# EAGLE design Mono_i2c_v2+TEMP (EAGLE 7.3.0)
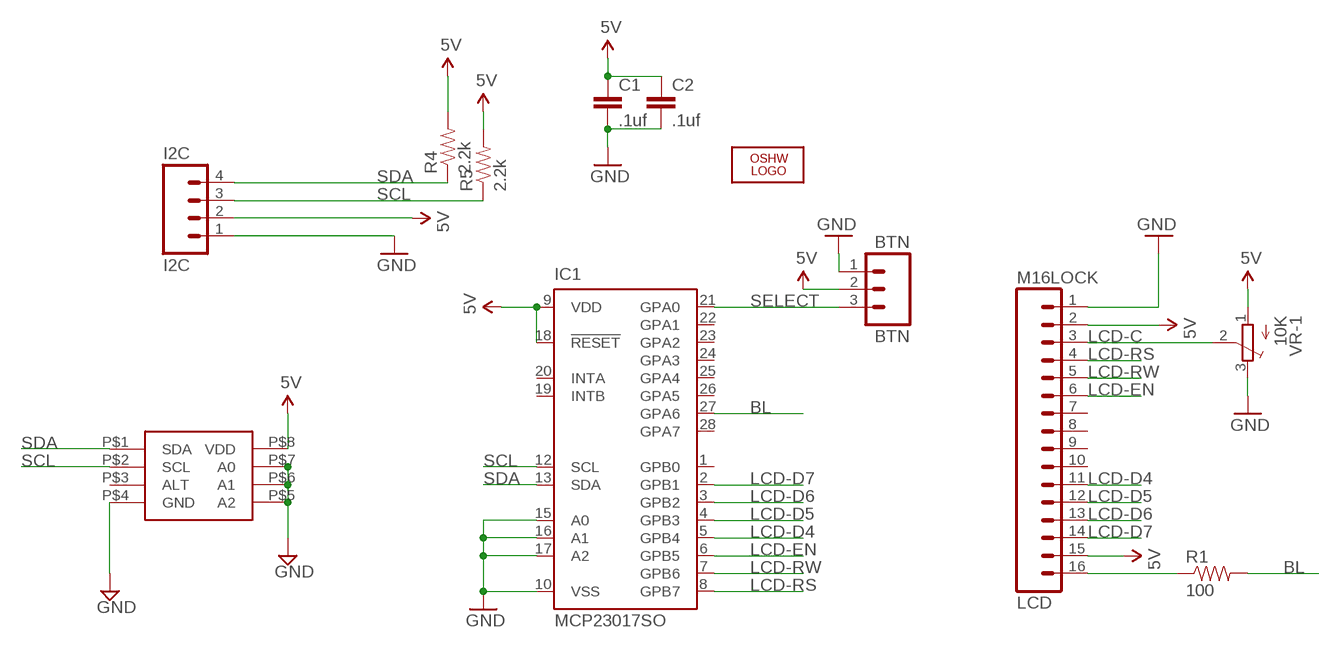
[diagram p0: schematic, sheet 1]

## Parts
BTN  BTN  M03LOCK  [1X03_LOCK]
C1  .1uf  CAP0805  [0805]
C2  .1uf  CAP0805  [0805]
I2C  I2C  M04LOCK  [1X04_LOCK]
IC1  MCP23017SO  [SO28W]
IC2  MCP9808  [MSOP8]
LCD  M16LOCK  [1X16_LOCK]
LOGO2  OSHW_LOGO_10MILX0350-NT  [OSHW_10X350_NOTEXT]
R1  100  RESISTOR0805-RES  [0805]
R4  2.2k  RESISTOR0805-RES  [0805]
R5  2.2k  RESISTOR0805-RES  [0805]
VR-1  10K  TRIMPOTTC33X  [TC33X]

## Nets
5V: BTN.2 C1.1 C2.1 I2C.2 IC1.9(VDD) IC1.18(!RESET) IC2.P$8(VDD) LCD.2 LCD.15 R4.2 R5.2 VR-1.1(A)
BL: IC1.27(GPA6) R1.2
GND: BTN.1 C1.2 C2.2 I2C.1 IC1.10(VSS) IC1.15(A0) IC1.16(A1) IC1.17(A2) IC2.P$4(GND) IC2.P$5(A2) IC2.P$6(A1) IC2.P$7(A0) LCD.1 VR-1.3(E)
LCD-C: LCD.3 VR-1.2(S)
LCD-D4: IC1.5(GPB4) LCD.11
LCD-D5: IC1.4(GPB3) LCD.12
LCD-D6: IC1.3(GPB2) LCD.13
LCD-D7: IC1.2(GPB1) LCD.14
LCD-EN: IC1.6(GPB5) LCD.6
LCD-RS: IC1.8(GPB7) LCD.4
LCD-RW: IC1.7(GPB6) LCD.5
N$4: LCD.16 R1.1
SCL: I2C.3 IC1.12(SCL) IC2.P$2(SCL) R5.1
SDA: I2C.4 IC1.13(SDA) IC2.P$1(SDA) R4.1
SELECT: BTN.3 IC1.21(GPA0)
Unconnected: IC1.1(GPB0) IC1.19(INTB) IC1.20(INTA) IC1.22(GPA1) IC1.23(GPA2) IC1.24(GPA3) IC1.25(GPA4) IC1.26(GPA5) IC1.28(GPA7) IC2.P$3(ALT) LCD.7 LCD.8 LCD.9 LCD.10

## Library data of the parts
BTN = SparkFun:M03: Header 3 Standard 3-pin 0.1" header. Use with straight break away headers (SKU : PRT-00116), right angle break away headers (PRT-00553), swiss pins (PRT-00743), machine pins (PRT-00117), and female headers (PRT-00115). Molex polarized connector foot print use with SKU : PRT-08232 with associated crimp pins and housings.
C1 C2 = SparkFun:CAP: Capacitor Standard 0603 ceramic capacitor, and 0.1" leaded capacitor.
I2C = SparkFun:M04: Header 4 Standard 4-pin 0.1" header. Use with straight break away headers (SKU : PRT-00116), right angle break away headers (PRT-00553), swiss pins (PRT-00743), machine pins (PRT-00117), and female headers (PRT-00115). Molex polarized connector foot print use with SKU : PRT-08231 with associated crimp pins and housings. 1MM SMD Version SKU: PRT-10208
IC1 = adafruit:MCP23017: http://ww1.microchip.com/downloads/en/DeviceDoc/21952a.pdf Source: http://ww1.microchip.com/downloads/en/DeviceDoc/21952a.pdf
IC2 = OpenEVSE:MCP9808
LCD = SparkFun:M16
LOGO2 = ohw-logo:OSHW_LOGO_10MIL
R1 R4 R5 = SparkFun:RESISTOR: Resistor Basic schematic elements and footprints for 0603, 1206, and PTH resistors.
VR-1 = adafruit:TRIMPOT: SMT trimmer potentiometer part number TC33X http://www.ladyada.net/library/eagle

## Board
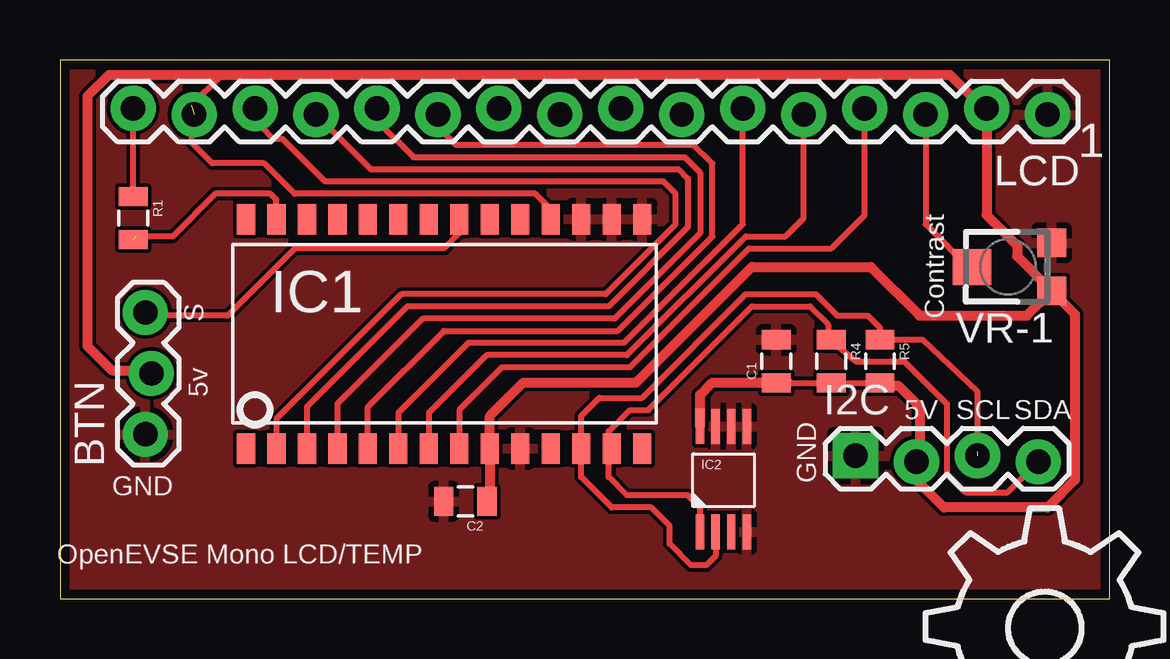
[diagram p1: board, top side]
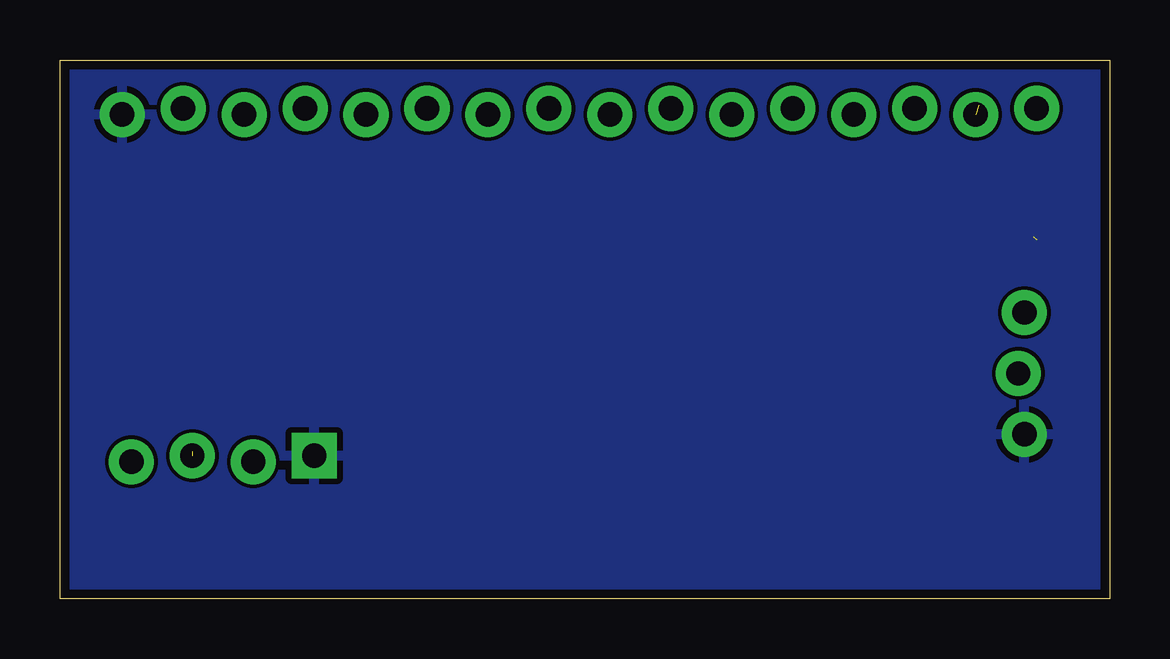
[diagram p2: board, bottom side, seen from below]

Size 43.74 x 22.47 mm. Coordinates in mm from the lower left corner, seen from the top.
Outline: 0,0 43.74,0 43.74,22.47 0,22.47 0,0
Copper layers (1*16): Top 0.0356mm / dielectric 1.5011mm / Bottom 0.0356mm
Design rules "default": minimum track width 6mil, minimum drill 13mil, track to track 6mil, track to pad 6mil, pad to pad 6mil, via to via 6mil, smd to smd 6mil, copper to edge 15mil, drill to drill 6mil, minimum pad ring 7mil, minimum via ring 7mil, stop-mask expansion 4mil, vias tented up to drill 0mil, thermal gap 10mil

### Footprints (pad centres in the part's own frame; a part is rotated, then mirrored left to right if it is on the bottom)
1X03_LOCK = drill 1.016 pad 1.88: 1 0,0.127; 2 2.54,-0.127; 3 5.08,0.127
0805 = smd 0.8 x 1.2: 1 -0.9,0; 2 0.9,0
1X04_LOCK = drill 1.016 pad 1.88 square: 1 0,0.127 | drill 1.016 pad 1.88: 2 2.54,-0.127; 3 5.08,0.127; 4 7.62,-0.127
SO28W = smd 0.762 x 1.27: 1 -7.62,-4.78; 2 -6.35,-4.78; 3 -5.08,-4.78; 4 -3.81,-4.78; 5 -2.54,-4.78; 6 -1.27,-4.78; 7 0,-4.78; 8 1.27,-4.78; 9 2.54,-4.78; 10 3.81,-4.78; 11 5.08,-4.78; 12 6.35,-4.78; 13 7.62,-4.78; 14 8.89,-4.78; 15 8.89,4.78; 16 7.62,4.78; 17 6.35,4.78; 18 5.08,4.78; 19 3.81,4.78; 20 2.54,4.78; 21 1.27,4.78; 22 0,4.78; 23 -1.27,4.78; 24 -2.54,4.78; 25 -3.81,4.78; 26 -5.08,4.78; 27 -6.35,4.78; 28 -7.62,4.78
MSOP8 = smd 0.35 x 1.45: P$1 0,0; P$2 0.65,0; P$3 1.3,0; P$4 1.95,0; P$5 1.95,4.4; P$6 1.3,4.4; P$7 0.65,4.4; P$8 0,4.4
1X16_LOCK = drill 1.016 pad 1.88: 1 0,0.127; 2 2.54,-0.127; 3 5.08,0.127; 4 7.62,-0.127; 5 10.16,0.127; 6 12.7,-0.127; 7 15.24,0.127; 8 17.78,-0.127; 9 20.32,0.127; 10 22.86,-0.127; 11 25.4,0.127; 12 27.94,-0.127; 13 30.48,0.127; 14 33.02,-0.127; 15 35.56,0.127; 16 38.1,-0.127
TC33X = smd 1.2 x 1.2: 1 -1,-1.825; 3 1,-1.825 | smd 1.5 x 1.6: 2 0,1.5

### Placement (x,y rotation side)
BTN  3.68,6.86 90 top
C1  29.84,9.91 90 top
C2  16.89,4.06 180 top
I2C  33.15,5.84 0 top
IC1  15.37,11.05 0 top
IC2  26.67,2.79 0 top
LCD  41.15,20.32 180 top
LOGO2  36.07,-5.08 0 top  (outside the outline)
R1  3.05,15.87 270 top
R4  32.13,9.91 270 top
R5  34.16,9.91 270 top
VR-1  39.5,13.84 90 top

### Tracks (layer width: path | path; a pad name or v marks a point on that pad's centre or on a via)
5V  (1 unrouted)
  Top 0.254: 30.11,8.89 C1.1 30.35,9.01 R4.2 R5.2 34.28,8.89 34.8,8.89 | 17.91,3.94 17.91,4.32 C2.1 | IC1.18 20.45,16.26 19.81,16.89 9.78,16.89 8.51,18.16 6.35,18.16 5.46,19.05 5.46,20.57 6.73,21.84
  Top 0.406: C2.1 17.91,4.18 IC1.9 17.91,7.62 19.3,9.02 24,9.02 28.83,13.84 33.78,13.84 35.81,11.81 40.29,11.81 VR-1.1 | VR-1.1 42.29,11.87 42.29,4.95 41.15,3.81 36.83,3.81 35.56,5.08 35.56,5.59 I2C.2 | VR-1.1 39.88,14.29 39.88,14.73 38.61,16 LCD.2 38.48,20.45 37.08,21.84 6.73,21.84 2.03,21.84 1.14,20.96 1.14,10.54 2.16,9.52 3.68,9.52 BTN.2 3.68,9.14 | 34.8,8.89 34.93,8.89 35.81,8 35.81,5.97 35.69,5.84 I2C.2 | 29.72,8.88 C1.1 | 35.81,5.59 I2C.2 | IC2.P$8 26.67,8.51 27.18,9.02 30.34,9.02 30.35,9.01
BL  (1 unrouted)
  Top 0.254: IC1.27 9.02,16.64 8.76,16.89 6.48,16.89 4.7,15.11 3.19,15.11
GND
  pour Top: -2.92,-6.35 48.64,-7.11 49.4,30.86 -3.05,32.77
  pour Bottom: -7.37,-5.71 46.36,-5.97 45.97,29.85 -7.87,29.72
LCD-C
  Top 0.254: LCD.3 36.07,15.62 37.97,13.72 37.97,13.87 VR-1.2
LCD-D4
  Top 0.254: IC1.5 12.83,8 16,11.18 23.24,11.18 27.18,15.11 27.18,18.16 26.42,18.92 16.51,18.92 15.75,19.69 LCD.11
LCD-D5
  Top 0.254: LCD.12 13.21,19.94 14.73,18.42 26.04,18.42 26.67,17.78 26.67,15.24 23.11,11.68 15.11,11.68 11.56,8.13 IC1.4
LCD-D6
  Top 0.254: LCD.13 12.95,17.91 25.78,17.91 26.16,17.53 26.16,15.49 22.86,12.19 14.48,12.19 10.29,8 IC1.3
LCD-D7
  Top 0.254: LCD.14 8.38,20.19 8.38,19.69 8.89,19.18 9.27,19.18 11.05,17.4 25.15,17.4 25.65,16.89 25.65,15.62 22.73,12.7 14.22,12.7 9.02,7.49 IC1.2
LCD-EN
  Top 0.254: LCD.6 28.45,15.62 23.49,10.67 17.02,10.67 14.1,7.75 IC1.6
LCD-RS
  Top 0.254: LCD.4 33.53,16 32.13,14.6 28.7,14.6 23.75,9.65 18.41,9.65 16.64,7.87 IC1.8
LCD-RW
  Top 0.254: LCD.5 30.99,15.87 30.23,15.11 28.57,15.11 23.62,10.16 17.78,10.16 15.37,7.75 IC1.7
N$4
  Top 0.254: R1.1 LCD.16
SCL  (1 unrouted)
  Top 0.254: 38.23,6.14 38.23,8.64 35.93,10.81 R5.1 34.16,11.3 33.66,11.81 32.39,11.81 31.5,12.7 28.57,12.7 24.26,8.38 22.48,8.38 21.72,7.62 IC1.12 | IC1.12 21.72,5.84 | IC2.P$2 27.32,1.79 26.92,1.4 26.29,1.4 25.4,2.29 25.4,3.05 24.64,3.81 22.99,3.81 21.72,5.08 IC1.12
SDA
  Top 0.254: IC1.13 22.86,6.65 22.86,6.99 23.75,7.87 24.51,7.87 28.83,12.19 31.24,12.19 32,11.43 32,10.93 R4.1 32.26,10.81 32.26,10.67 33.15,9.91 35.18,9.91 36.96,8.13 36.96,5.21 37.72,4.45 39.5,4.45 I2C.4 | 22.99,5.71 IC1.13 | IC2.P$1 26.67,3.81 26.16,4.32 23.62,4.32 22.86,5.08 22.86,6.14 IC1.13
SELECT
  Top 0.254: IC1.21 16.64,15.24 16,14.6 9.78,14.6 6.98,11.81 3.73,11.81
  Top 0.406: 3.73,11.81 BTN.3

### Text on the board
tNames: 1 | S | Contrast | 5v | 5V | SCL | SDA | GND | GND | OpenEVSE Mono LCD/TEMP